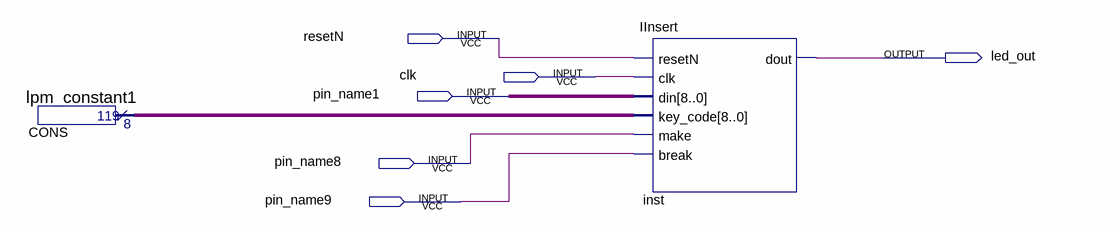
[diagram p0: schematic sheet]
// Quartus schematic TEST_NumLock.bdf as structural Verilog: 2 symbols, 6 pins
module TEST_NumLock (
  input  resetN,
  input  clk,
  input  pin_name1,
  input  pin_name8,
  input  pin_name9,
  output led_out
);

  wire [8:0] CONS_result, undriven;

  lpm_constant1 CONS (.result(CONS_result));
  IInsert inst (
    .resetN(resetN), .clk(clk), .din(undriven), .key_code(CONS_result), .make(pin_name8),
    .\break (pin_name9), .dout(led_out));
endmodule
